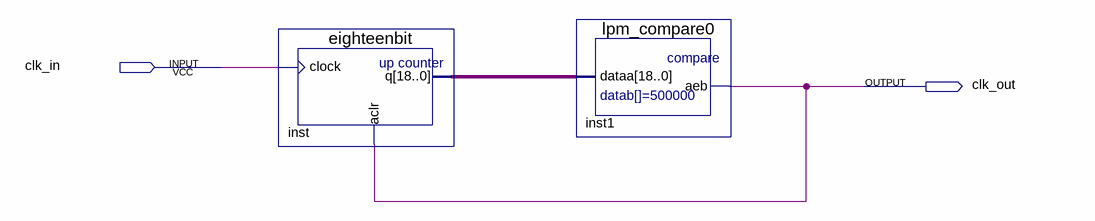
[diagram p0: schematic sheet]
// Quartus schematic newcounter.bdf as structural Verilog: 2 symbols, 2 pins
module newcounter (
  input  clk_in,
  output clk_out
);

  wire [18:0] inst_q;

  eighteenbit inst (.clock(clk_in), .aclr(clk_out), .q(inst_q));
  lpm_compare0 inst1 (.dataa(inst_q), .aeb(clk_out));
endmodule
